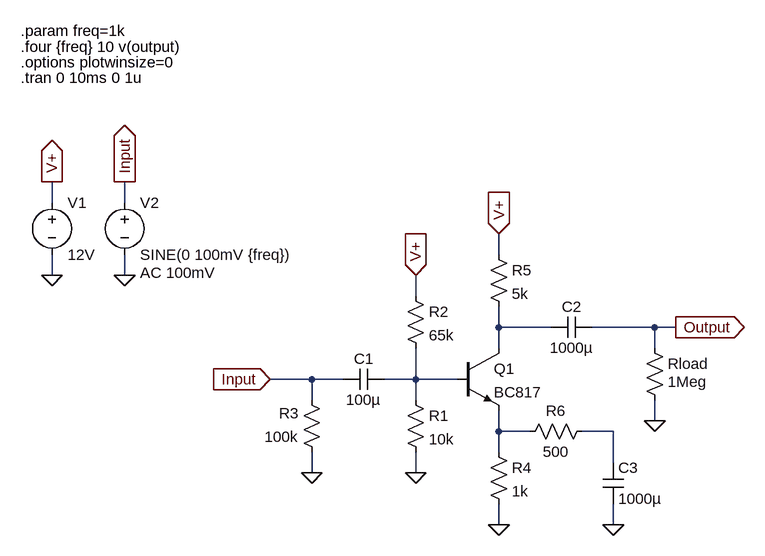
[diagram p0: schematic Common-Emitter Series Feedback.asc]
Common-Emitter Series Feedback.asc, the LTspice schematic file:
Version 4
SHEET 1 880 680
WIRE -304 -64 -304 -96
WIRE -192 -64 -192 -96
WIRE 384 16 384 -16
WIRE -304 48 -304 16
WIRE -192 48 -192 16
WIRE 256 80 256 48
WIRE 384 128 384 96
WIRE 464 128 384 128
WIRE 624 128 528 128
WIRE 656 128 624 128
WIRE 384 160 384 128
WIRE 624 160 624 128
WIRE 96 208 32 208
WIRE 144 208 96 208
WIRE 256 208 256 160
WIRE 256 208 208 208
WIRE 320 208 256 208
WIRE 96 240 96 208
WIRE 256 240 256 208
WIRE 624 272 624 240
WIRE 384 288 384 256
WIRE 432 288 384 288
WIRE 560 288 512 288
WIRE 384 320 384 288
WIRE 560 336 560 288
WIRE 96 352 96 320
WIRE 256 352 256 320
WIRE 384 432 384 400
WIRE 560 432 560 400
FLAG 384 -16 V+
IOPIN 384 -16 In
FLAG 256 352 0
FLAG 32 208 Input
IOPIN 32 208 In
FLAG -304 48 0
FLAG -192 48 0
FLAG -304 -96 V+
IOPIN -304 -96 Out
FLAG -192 -96 Input
IOPIN -192 -96 Out
FLAG 96 352 0
FLAG 624 272 0
FLAG 256 48 V+
IOPIN 256 48 In
FLAG 384 432 0
FLAG 656 128 Output
IOPIN 656 128 Out
FLAG 560 432 0
SYMBOL npn 320 160 R0
SYMATTR InstName Q1
SYMATTR Value BC817
SYMBOL res 240 224 R0
SYMATTR InstName R1
SYMATTR Value 10k
SYMBOL cap 208 192 R90
WINDOW 0 0 32 VBottom 2
WINDOW 3 32 32 VTop 2
SYMATTR InstName C1
SYMATTR Value 100µ
SYMBOL voltage -304 -80 R0
WINDOW 123 0 0 Left 0
WINDOW 39 0 0 Left 0
SYMATTR InstName V1
SYMATTR Value 12V
SYMBOL voltage -192 -80 R0
WINDOW 123 24 124 Left 2
WINDOW 39 0 0 Left 0
SYMATTR Value2 AC 100mV
SYMATTR InstName V2
SYMATTR Value SINE(0 100mV {freq})
SYMBOL res 112 336 R180
WINDOW 0 36 76 Left 2
WINDOW 3 36 40 Left 2
SYMATTR InstName R3
SYMATTR Value 100k
SYMBOL res 608 144 R0
WINDOW 3 36 68 Left 2
SYMATTR Value 1Meg
SYMATTR InstName Rload
SYMBOL res 240 64 R0
SYMATTR InstName R2
SYMATTR Value 65k
SYMBOL cap 528 112 R90
WINDOW 0 0 32 VBottom 2
WINDOW 3 32 32 VTop 2
SYMATTR InstName C2
SYMATTR Value 1000µ
SYMBOL res 368 304 R0
SYMATTR InstName R4
SYMATTR Value 1k
SYMBOL res 368 0 R0
SYMATTR InstName R5
SYMATTR Value 5k
SYMBOL cap 544 336 R0
SYMATTR InstName C3
SYMATTR Value 1000µ
SYMBOL res 528 272 R90
WINDOW 0 0 56 VBottom 2
WINDOW 3 32 56 VTop 2
SYMATTR InstName R6
SYMATTR Value 500
TEXT -352 -256 Left 2 !.tran 0 10ms 0 1u
TEXT -352 -280 Left 2 !.options plotwinsize=0
TEXT -352 -304 Left 2 !.four {freq} 10 v(output)
TEXT -352 -328 Left 2 !.param freq=1k

The netlist it stands for:
* Common-Emitter Series Feedback.asc
Q1 N001 N002 N003 0 BC817
R1 N002 0 10k
C1 N002 Input 100µ
V1 V+ 0 12V
V2 Input 0 SINE(0 100mV {freq}) AC 100mV
R3 0 Input 100k
Rload Output 0 1Meg
R2 V+ N002 65k
C2 Output N001 1000µ
R4 N003 0 1k
R5 V+ N001 5k
C3 N004 0 1000µ
R6 N004 N003 500
.model NPN NPN
.model PNP PNP
.lib standard.bjt
.tran 0 10ms 0 1u
.options plotwinsize=0
.four {freq} 10 v(output)
.param freq=1k
.backanno
.end